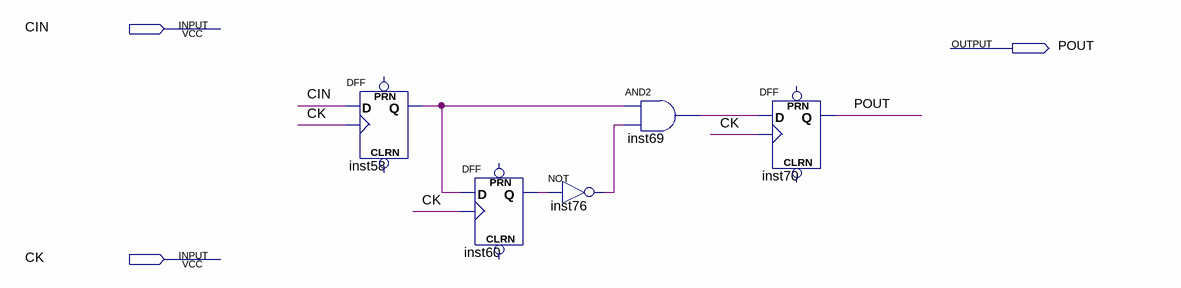
[diagram p0: schematic sheet]
// Quartus schematic Pulser1.bdf as structural Verilog: 5 symbols, 3 pins
module Pulser1 (
  input  CIN,
  input  CK,
  output POUT
);

  wire inst58_q, inst60_q, inst69_out, inst76_out;

  DFF inst58 (.CLK(CK), .D(CIN), .Q(inst58_q));  // open: CLRN, PRN
  DFF inst60 (.CLK(CK), .D(inst58_q), .Q(inst60_q));  // open: CLRN, PRN
  not inst76 (inst76_out, inst60_q);
  and inst69 (inst69_out, inst58_q, inst76_out);
  DFF inst70 (.CLK(CK), .D(inst69_out), .Q(POUT));  // open: CLRN, PRN
endmodule
